# Altium project BalanceCar_20210328.PrjPcb
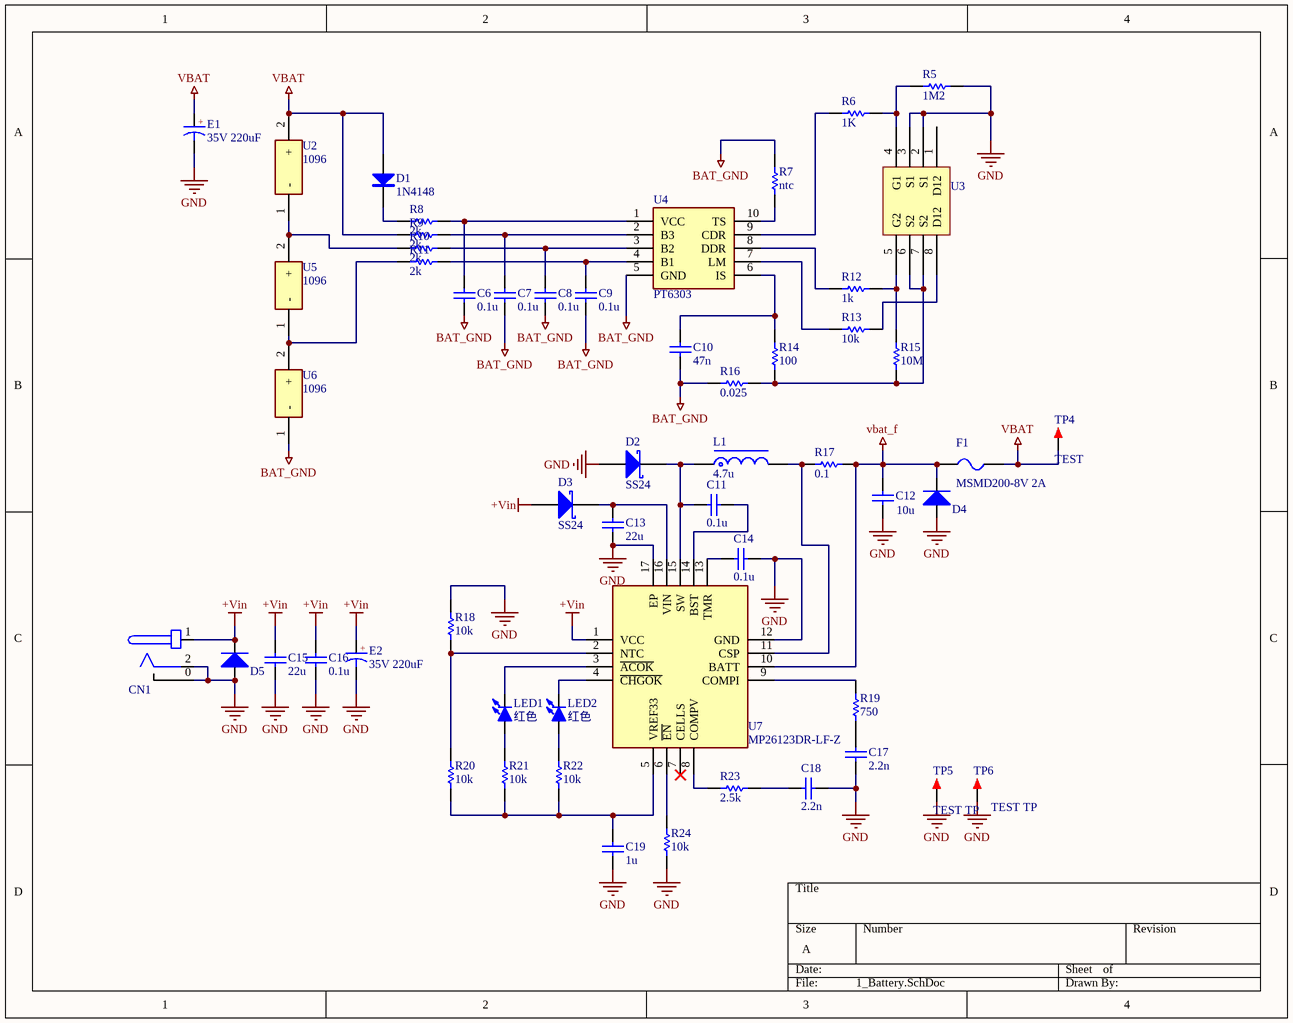
[diagram p0: 1_Battery.SchDoc]
6 sheets, 162 parts. Net scope: global (net labels, ports and power ports of the same name join across sheets).
Board file: BalanceCar.PcbDoc
Sheets:
  1_Battery.SchDoc
  2_Power.SchDoc
  3_MCU.SchDoc
  4_MotorDrive.SchDoc
  5_Ble.SchDoc
  6_mpu6050.SchDoc

## Sheet 1_Battery.SchDoc
size A

### Parts
C6  0.1u  [CAP_0603_SMD]
C7  0.1u  [CAP_0603_SMD]
C8  0.1u  [CAP_0603_SMD]
C9  0.1u  [CAP_0603_SMD]
C10  47n  [CAP_0603_SMD]
C11  0.1u  [CAP_0603_SMD]
C12  10u  [C1206_L]
C13  22u  [C1812_L]
C14  0.1u  [CAP_0603_SMD]
C15  22u  [C1812_L]
C16  0.1u  [CAP_0603_SMD]
C17  2.2n  [CAP_0603_SMD]
C18  2.2n  [CAP_0603_SMD]
C19  1u  [CAP_0603_SMD]
CN1  PWR5.5x2.1_HP  [PWR5.5x2.1_HP]  (value not drawn)
D1  1N4148  [SOD-323]
D2  SS24  [SMB]
D3  SS24  [SMB]
D4  TVS  [SMA]  (value not drawn)
D5  TVS  [SMA]  (value not drawn)
E1  35V 220uF  [CE E(8*10.2)]
E2  35V 220uF  [CE E(8*10.2)]
F1  MSMD200-8V 2A  [FU 1812]
L1  4.7u  [L-SMD-0630]
LED1  红色  [LED0603_Y]
LED2  红色  [LED0603_Y]
R5  1M2  [RES_0603_SMD]
R6  1K  [RES_0603_SMD]
R7  ntc  [RES_0603_SMD]
R8  2k  [RES_0603_SMD]
R9  2k  [RES_0603_SMD]
R10  2k  [RES_0603_SMD]
R11  2k  [RES_0603_SMD]
R12  1k  [RES_0603_SMD]
R13  10k  [RES_0603_SMD]
R14  100  [RES_0603_SMD]
R15  10M  [RES_0603_SMD]
R16  0.025  [RES_1206_SMD]
R17  0.1  [RES_1206_SMD]
R18  10k  [RES_0603_SMD]
R19  750  [RES_0603_SMD]
R20  10k  [RES_0603_SMD]
R21  10k  [RES_0603_SMD]
R22  10k  [RES_0603_SMD]
R23  2.5k  [RES_0603_SMD]
R24  10k  [RES_0603_SMD]
TP4  TEST  [TEST 1.2]
TP5  TEST TP  [TEST TP1.4_BK]
TP6  TEST TP  [TEST TP1.4_BK]
U2  1096  [1096]
U3  FS8205A TSSOP-8  [IC_TSSOP-8]  (value not drawn)
U4  PT6303  [SOP50P490X110-10N]
U5  1096  [1096]
U6  1096  [1096]
U7  MP26123DR-LF-Z  [QFN65P400X400X100-17N-D]

### Nets
+Vin: C15.2 C16.2 CN1.1(+) D3.1(A) D5.2(K) E2.1 U7.1(VCC)
BAT_GND: C6.2 C7.2 C8.2 C9.2 C10.2 R7.1 R16.1 U4.5(GND) U6.1(-)
GND: C12.1 C13.1 C14.2 C15.1 C16.1 C17.1 C18.1 C19.2 CN1.0(SHIELD) CN1.2(GND) D2.1(A) D4.1(A) D5.1(A) E1.2 E2.2 R5.1 R18.2 R24.2 TP5.1 TP6.1 U3.2(S1) U3.3(S1) U7.12(GND) U7.17(EP)
VBAT: D1.1(A) E1.1 F1.2 R9.2 TP4.1 U2.2(+)
vbat_f: C12.2 D4.2(K) F1.1 R17.2 U7.10(BATT)
NetC6_1: C6.1 R8.1 U4.1(VCC)
NetC7_1: C7.1 R9.1 U4.2(B3)
NetC8_1: C8.1 R10.1 U4.3(B2)
NetC9_1: C9.1 R11.1 U4.4(B1)
NetC10_1: C10.1 R14.1 U4.6(IS)
NetC11_1: C11.1 D2.2(K) L1.1 U7.15(SW)
NetC11_2: C11.2 U7.14(BST)
NetC13_2: C13.2 D3.2(K) U7.16(VIN)
NetC14_1: C14.1 U7.13(TMR)
NetC17_2: C17.2 R19.2
NetC18_2: C18.2 R23.1
NetC19_1: C19.1 R20.1 R21.1 R22.1 U7.5(VREF33)
NetD1_2: D1.2(K) R8.2
NetL1_2: L1.2 R17.1 U7.11(CSP)
NetLED1_1: LED1.1(A) R21.2
NetLED1_2: LED1.2(K) U7.3(~{ACOK})
NetLED2_1: LED2.1(A) R22.2
NetLED2_2: LED2.2(K) U7.4(~{CHGOK})
NetR5_2: R5.2 R6.1 U3.4(G1)
NetR6_2: R6.2 U4.9(CDR)
NetR7_2: R7.2 U4.10(TS)
NetR10_2: R10.2 U2.1(-) U5.2(+)
NetR11_2: R11.2 U5.1(-) U6.2(+)
NetR12_1: R12.1 R15.1 U3.5(G2)
NetR12_2: R12.2 U4.8(DDR)
NetR13_1: R13.1 U3.8(D12)
NetR13_2: R13.2 U4.7(LM)
NetR14_2: R14.2 R15.2 R16.2 U3.6(S2) U3.7(S2)
NetR18_1: R18.1 R20.2 U7.2(NTC)
NetR19_1: R19.1 U7.9(COMPI)
NetR23_2: R23.2 U7.8(COMPV)
NetR24_1: R24.1 U7.6(~{EN})

Not connected (* = marked no-connect by the designer): U3 1(D12); U7 7(CELLS)*

### Notes on the sheet
- (in symbol CE_SMD) +

### Library data of the parts
C6-C11 C14 C16-C19 = CAP_0603_SMD: Capacitor, 0603, SMD; Published: 8-Jun-2000; LatestRevisionDate: 17-Jul-2002; LatestRevisionNote: Re-released for DXP Platform.; PackageReference: RAD-0.3; Publisher: Altium Limited
C12 C13 C15 = C: 贴片电容; BOM名称: 无极性贴片电容; 联系卖家，免费查找封装: 唯一出售店铺网址https://shop463601444.taobao.com; 封装库来自淘宝卖家ID：黄晶宝石: 其他店铺购入均为盗版假冒封装库，请立即申请退款
CN1 = PWR5.5x2.1_HP: DC Socket, 5.5x2.1, High-power
D1 = 1N4148: 开关二极管; BOM名称: 高速开关二极管; 联系卖家，免费查找封装: 唯一出售店铺网址https://shop463601444.taobao.com
D2 D3 = SS24: 肖特基二极管; 属性: 40V/2A; 联系卖家，免费查找封装: 唯一出售店铺网址https://shop463601444.taobao.com; BOM名称: 肖特基二极管
D4 D5 = TVS: TVS通用; 联系卖家，免费查找封装: 唯一出售店铺网址https://shop463601444.taobao.com; Code_JEDEC: DO-214-AB
E1 E2 = CE_SMD: 贴片电解电容; 联系卖家，免费查找封装: 唯一出售店铺网址https://shop463601444.taobao.com; 封装库来自淘宝卖家ID：黄晶宝石: 其他店铺购入均为盗版假冒封装库，请立即申请退款; BOM名称: 贴片电解电容
F1 = FU: 贴片保险丝; 联系卖家，免费查找封装: 唯一出售店铺网址https://shop463601444.taobao.com; BOM名称: 贴片保险丝
L1 = L-Molding Choke: 一体成型电感; 联系卖家，免费查找封装: 唯一出售店铺网址https://shop463601444.taobao.com; 封装库来自淘宝卖家ID：黄晶宝石: 其他店铺购入均为盗版假冒封装库，请立即申请退款; BOM名称: 一体成型电感
LED1 LED2 = LED-SMD: 贴片LED; 封装库来自淘宝卖家 ID：黄晶宝石: 其他店铺购入均为假冒，请立即申请退款，本店奖励现金5~20元; BOM名称: 贴片LED
R5-R15 R18-R24 = RES_0603_SMD: Resistor, 0603, SMD; Published: 8-Jun-2000; LatestRevisionDate: 17-Jul-2002; LatestRevisionNote: Re-released for DXP Platform.; PackageReference: AXIAL-0.3; Publisher: Altium Limited; Value: Value
R16 R17 = RES_1206_SMD: Resistor, 1206, SMD; Published: 8-Jun-2000; LatestRevisionDate: 17-Jul-2002; LatestRevisionNote: Re-released for DXP Platform.; PackageReference: AXIAL-0.3; Publisher: Altium Limited; Value: Value
TP4 = TEST: 测试点; 联系卖家，免费查找封装: 唯一出售店铺网址https://shop463601444.taobao.com; BOM名称: 测试点
TP5 TP6 = TEST TP: 测试环; 联系卖家，免费查找封装: 唯一出售店铺网址https://shop463601444.taobao.com; BOM名称: 测试环
U2 U5 U6 = 1096: Undefined or Miscellaneous; Manufacturer_Name: Keystone Electronics; Datasheet Link: http://www.keyelco.com/product-pdf.cfm?p=14034; Height: 14.86mm; Manufacturer_Part_Number: 1096; Mouser Part Number: 534-1096; Mouser Price/Stock: https://www.mouser.co.uk/ProductDetail/Keystone-Electronics/1096?qs=lpFmnCe%2FWT9bsXx2ZUVLWQ%3D%3D
U3 = FS8205A TSSOP-8: Dual N-Channel Enhancement Mode Power MOSFET
U4 = PT6303: Integrated Circuit; Datasheet Link: http://www.analog.com/media/en/technical-documentation/data-sheets/AD4001-4005.pdf; Height: 1.1mm; Arrow Part Number: AD4001BRMZ; Arrow Price/Stock: https://www.arrow.com/en/products/ad4001brmz/analog-devices
U7 = MP26123DR-LF-Z: Integrated Circuit; Manufacturer_Name: Monolithic Power Systems (MPS); Datasheet Link: https://www.monolithicpower.com/pub/media/document/MP26123_r1.01.pdf; Height: 1mm; Manufacturer_Part_Number: MP26123DR-LF-Z; Mouser Part Number: 946-MP26123DRLFZ; Mouser Price/Stock: https://www.mouser.co.uk/ProductDetail/Monolithic-Power-Systems-MPS/MP26123DR-LF-Z?qs=ddTkeYFZflVgOJRHHyrLxQ%3D%3D

## Sheet 2_Power.SchDoc
size A
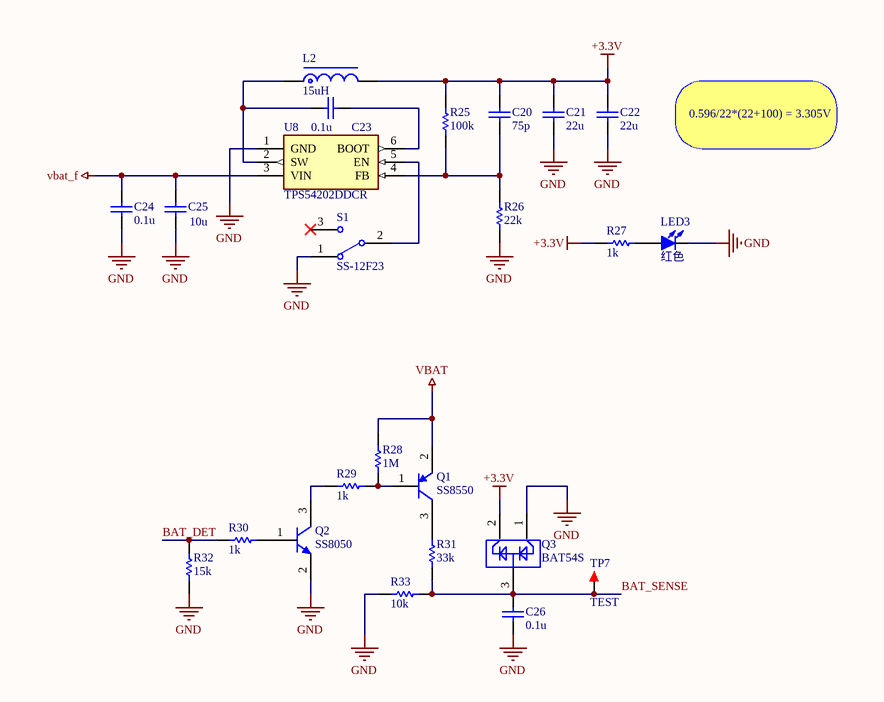
[diagram p1: 2_Power.SchDoc]

### Parts
C20  75p  [CAP_0603_SMD]
C21  22u  [C1206_L]
C22  22u  [C1206_L]
C23  0.1u  [CAP_0603_SMD]
C24  0.1u  [CAP_0603_SMD]
C25  10u  [C1206_L]
C26  0.1u  [CAP_0603_SMD]
L2  15uH  [L-SMD-0630]
LED3  红色  [LED0603_Y]
Q1  SS8550  [TR_SOT-23]
Q2  SS8050  [TR_SOT-23]
Q3  BAT54S  [TR_SOT-23]
R25  100k  [RES_0603_SMD]
R26  22k  [RES_0603_SMD]
R27  1k  [RES_0603_SMD]
R28  1M  [RES_0603_SMD]
R29  1k  [RES_0603_SMD]
R30  1k  [RES_0603_SMD]
R31  33k  [RES_0603_SMD]
R32  15k  [RES_0603_SMD]
R33  10k  [RES_0603_SMD]
S1  SS-12F23  [SS-12F23]
TP7  TEST  [TEST 1.2]
U8  TPS54202DDCR  [SOT95P280X110-6N]

### Nets
+3.3V: C20.1 C21.2 C22.2 L2.2 Q3.2 R25.2 R27.2
GND: C21.1 C22.1 C24.1 C25.1 C26.1 LED3.2(K) Q2.2(E) Q3.1 R26.1 R32.1 R33.1 S1.1 U8.1(GND)
VBAT: Q1.2(E) R28.2
vbat_f: C24.2 C25.2 U8.3(VIN)
BAT_DET: R30.1 R32.2
BAT_SENSE: C26.2 Q3.3 R31.2 R33.2 TP7.1
NetC20_2: C20.2 R25.1 R26.2 U8.4(FB)
NetC23_1: C23.1 U8.6(BOOT)
NetC23_2: C23.2 L2.1 U8.2(SW)
NetLED3_1: LED3.1(A) R27.1
NetQ1_1: Q1.1(B) R28.1 R29.1
NetQ1_3: Q1.3(C) R31.1
NetQ2_1: Q2.1(B) R30.2
NetQ2_3: Q2.3(C) R29.2
NetS1_2: S1.2 U8.5(EN)

Not connected (* = marked no-connect by the designer): S1 3*

### Notes on the sheet
- 0.596/22*(22+100) = 3.305V

### Library data of the parts
C20 C23 C24 C26 = CAP_0603_SMD: Capacitor, 0603, SMD; Published: 8-Jun-2000; LatestRevisionDate: 17-Jul-2002; LatestRevisionNote: Re-released for DXP Platform.; PackageReference: RAD-0.3; Publisher: Altium Limited
C21 C22 C25 = C: as C12 on sheet 1_Battery
L2 = L-Molding Choke: as L1 on sheet 1_Battery; BOM名称: 一体成型电感
LED3 = LED-SMD: as LED1 on sheet 1_Battery; BOM名称: 贴片LED
Q1 = PNP SS8550: PNP SS8550, -25V -1.5A, SOT-23; Published: 8-Jun-2000; LatestRevisionDate: 29-May-2009; LatestRevisionNote: IPC-7351 Footprint Added.; PackageVersion: Aug-1999; PackageReference: SOT-23B; Publisher: Altium Limited; PackageDescription: 3-Pin SOT-23 Package 0.95 mm Pitch, 2.4 mm Lead Span
Q2 = NPN SS8050: NPN SS8050, 25V 1.5A, SOT-23; Published: 8-Jun-2000; LatestRevisionDate: 17-Jul-2002; LatestRevisionNote: Re-released for DXP Platform.; PackageReference: TO-226; Publisher: Altium Limited; Code_JEDEC: TO-226-AA
Q3 = BAT54S: Dual Schottky Diodes, SOT23
R25-R33 = RES_0603_SMD: Resistor, 0603, SMD; Published: 8-Jun-2000; LatestRevisionDate: 17-Jul-2002; LatestRevisionNote: Re-released for DXP Platform.; PackageReference: AXIAL-0.3; Publisher: Altium Limited; Value: Value
S1 = SSW-1P: 1路波动开关; BOM名称: 波动开关; 联系卖家，免费查找封装: 唯一出售店铺网址https://shop463601444.taobao.com
TP7 = TEST: as TP4 on sheet 1_Battery; BOM名称: 测试点
U8 = TPS54202DDCR: Power Supply; Manufacturer_Name: Texas Instruments; Datasheet Link: http://www.ti.com/lit/gpn/tps54202; Height: 1.1mm; Manufacturer_Part_Number: TPS54202DDCR; Arrow Part Number: TPS54202DDCR; Arrow Price/Stock: https://www.arrow.com/en/products/tps54202ddcr/texas-instruments; Mouser Part Number: 595-TPS54202DDCR; Mouser Price/Stock: https://www.mouser.co.uk/ProductDetail/Texas-Instruments/TPS54202DDCR?qs=uP22XH7NdCsJtN%2Fq54jCtQ%3D%3D

## Sheet 3_MCU.SchDoc
size A
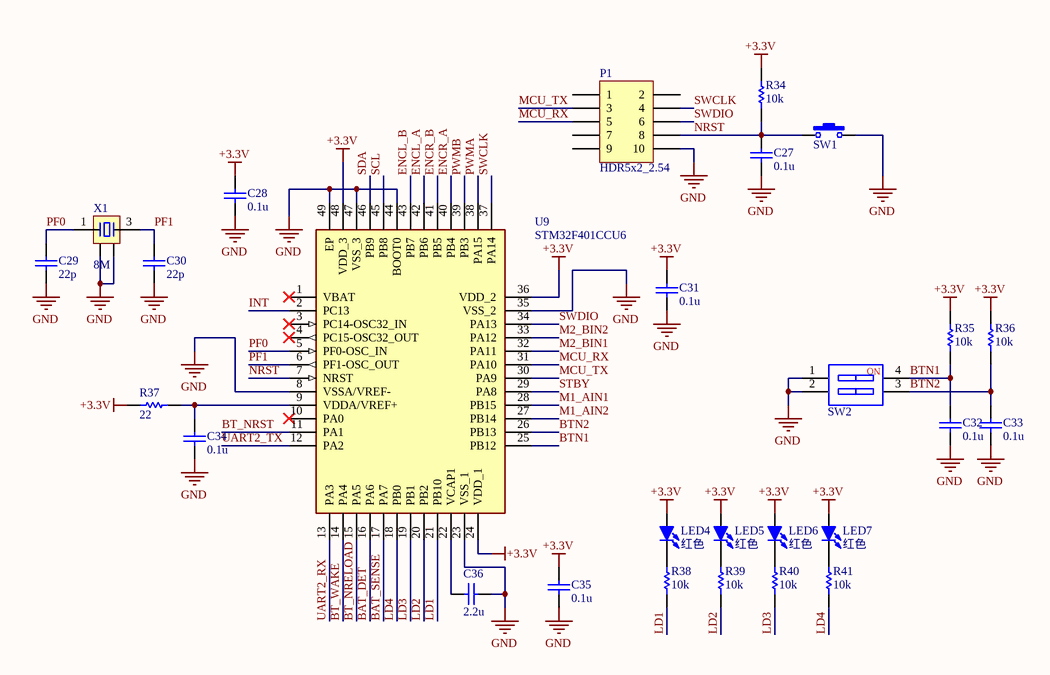
[diagram p2: 3_MCU.SchDoc]

### Parts
C27  0.1u  [CAP_0603_SMD]
C28  0.1u  [CAP_0603_SMD]
C29  22p  [CAP_0603_SMD]
C30  22p  [CAP_0603_SMD]
C31  0.1u  [CAP_0603_SMD]
C32  0.1u  [CAP_0603_SMD]
C33  0.1u  [CAP_0603_SMD]
C34  0.1u  [CAP_0603_SMD]
C35  0.1u  [CAP_0603_SMD]
C36  2.2u  [CAP_0603_SMD]
LED4  红色  [LED0603_Y]
LED5  红色  [LED0603_Y]
LED6  红色  [LED0603_Y]
LED7  红色  [LED0603_Y]
P1  HDR5x2_2.54  [HDR5x2_2.54]
R34  10k  [RES_0603_SMD]
R35  10k  [RES_0603_SMD]
R36  10k  [RES_0603_SMD]
R37  22  [RES_0603_SMD]
R38  10k  [RES_0603_SMD]
R39  10k  [RES_0603_SMD]
R40  10k  [RES_0603_SMD]
R41  10k  [RES_0603_SMD]
SW1  3x6x5  [SW SMD-3*6*4.3]  (value not drawn)
SW2  SW-2P  [SW1.27 SMD-2P]  (value not drawn)
U9  STM32F401CCU6  [QFN50P700X700X60-49N-D]
X1  8M  [OSC 3225-4P]

### Nets
+3.3V: C28.1 C31.1 C35.1 LED4.1(A) LED5.1(A) LED6.1(A) LED7.1(A) R34.2 R35.1 R36.1 R37.2 U9.24(VDD_1) U9.36(VDD_2) U9.48(VDD_3)
GND: C27.1 C28.2 C29.2 C30.2 C31.2 C32.1 C33.1 C34.2 C35.2 C36.1 P1.10 SW1.2 SW2.1 SW2.2 U9.8(VSSA/VREF-) U9.23(VSS_1) U9.35(VSS_2) U9.44(BOOT0) U9.47(VSS_3) U9.49(EP) X1.2 X1.4
BAT_DET: U9.16(PA6)
BAT_SENSE: U9.17(PA7)
BT_NRELOAD: U9.15(PA5)
BT_NRST: U9.11(PA1)
BT_WAKE: U9.14(PA4)
BTN1: C32.2 R35.2 SW2.4 U9.25(PB12)
BTN2: C33.2 R36.2 SW2.3 U9.26(PB13)
ENCL_A: U9.42(PB6)
ENCL_B: U9.43(PB7)
ENCR_A: U9.40(PB4)
ENCR_B: U9.41(PB5)
INT: U9.2(PC13)
LD1: R38.2 U9.21(PB10)
LD2: R39.2 U9.20(PB2)
LD3: R40.2 U9.19(PB1)
LD4: R41.2 U9.18(PB0)
M1_AIN1: U9.28(PB15)
M1_AIN2: U9.27(PB14)
M2_BIN1: U9.32(PA11)
M2_BIN2: U9.33(PA12)
MCU_RX: P1.5 U9.31(PA10)
MCU_TX: P1.3 U9.30(PA9)
NRST: C27.2 P1.8 R34.1 SW1.1 U9.7(NRST)
PF0: C29.1 U9.5(PF0-OSC_IN) X1.1
PF1: C30.1 U9.6(PF1-OSC_OUT) X1.3
PWMA: U9.38(PA15)
PWMB: U9.39(PB3)
SCL: U9.45(PB8)
SDA: U9.46(PB9)
STBY: U9.29(PA8)
SWCLK: P1.4 U9.37(PA14)
SWDIO: P1.6 U9.34(PA13)
UART2_RX: U9.13(PA3)
UART2_TX: U9.12(PA2)
NetC34_1: C34.1 R37.1 U9.9(VDDA/VREF+)
NetC36_2: C36.2 U9.22(VCAP1)
NetLED4_2: LED4.2(K) R38.1
NetLED5_2: LED5.2(K) R39.1
NetLED6_2: LED6.2(K) R40.1
NetLED7_2: LED7.2(K) R41.1

Not connected (* = marked no-connect by the designer): P1 1 2 7 9; U9 1(VBAT)* 3(PC14-OSC32_IN)* 4(PC15-OSC32_OUT)* 10(PA0)*

### Notes on the sheet
- (in symbol SW-2P) NO

### Library data of the parts
C27-C36 = CAP_0603_SMD: Capacitor, 0603, SMD; Published: 8-Jun-2000; LatestRevisionDate: 17-Jul-2002; LatestRevisionNote: Re-released for DXP Platform.; PackageReference: RAD-0.3; Publisher: Altium Limited
LED4-LED7 = LED-SMD: as LED1 on sheet 1_Battery; BOM名称: 贴片LED
P1 = HDR5x2_2.54: Header, 10-Pin, 2-Row; LatestRevisionDate: 17-Jul-2002; LatestRevisionNote: Re-released for DXP Platform.; Publisher: Altium Limited
R34-R41 = RES_0603_SMD: Resistor, 0603, SMD; Published: 8-Jun-2000; LatestRevisionDate: 17-Jul-2002; LatestRevisionNote: Re-released for DXP Platform.; PackageReference: AXIAL-0.3; Publisher: Altium Limited; Value: Value
SW1 = SW-PB: 微动开关; BOM名称: 3x6轻触开关; 联系卖家，免费查找封装: 唯一出售店铺网址https://shop463601444.taobao.com
SW2 = SW-2P: 2路编码开关; 联系卖家，免费查找封装: 唯一出售店铺网址https://shop463601444.taobao.com; BOM名称: 2路编码开关
U9 = STM32F401CCU6: Integrated Circuit; Manufacturer_Name: STMicroelectronics; Datasheet Link: http://www.st.com/web/en/resource/technical/document/datasheet/DM00086815.pdf; Height: 0.6mm; Manufacturer_Part_Number: STM32F401CCU6; Mouser Part Number: 511-STM32F401CCU6; Mouser Price/Stock: https://www.mouser.co.uk/ProductDetail/STMicroelectronics/STM32F401CCU6?qs=DqCdCwOw4%2F5VrOZQxO795A%3D%3D; Arrow Part Number: STM32F401CCU6; Arrow Price/Stock: https://www.arrow.com/en/products/stm32f401ccu6/stmicroelectronics
X1 = XTAL-4P: 4脚无源晶振; 联系卖家，免费查找封装: 唯一出售店铺网址https://shop463601444.taobao.com; BOM名称: 4脚无源晶振

## Sheet 4_MotorDrive.SchDoc
size A
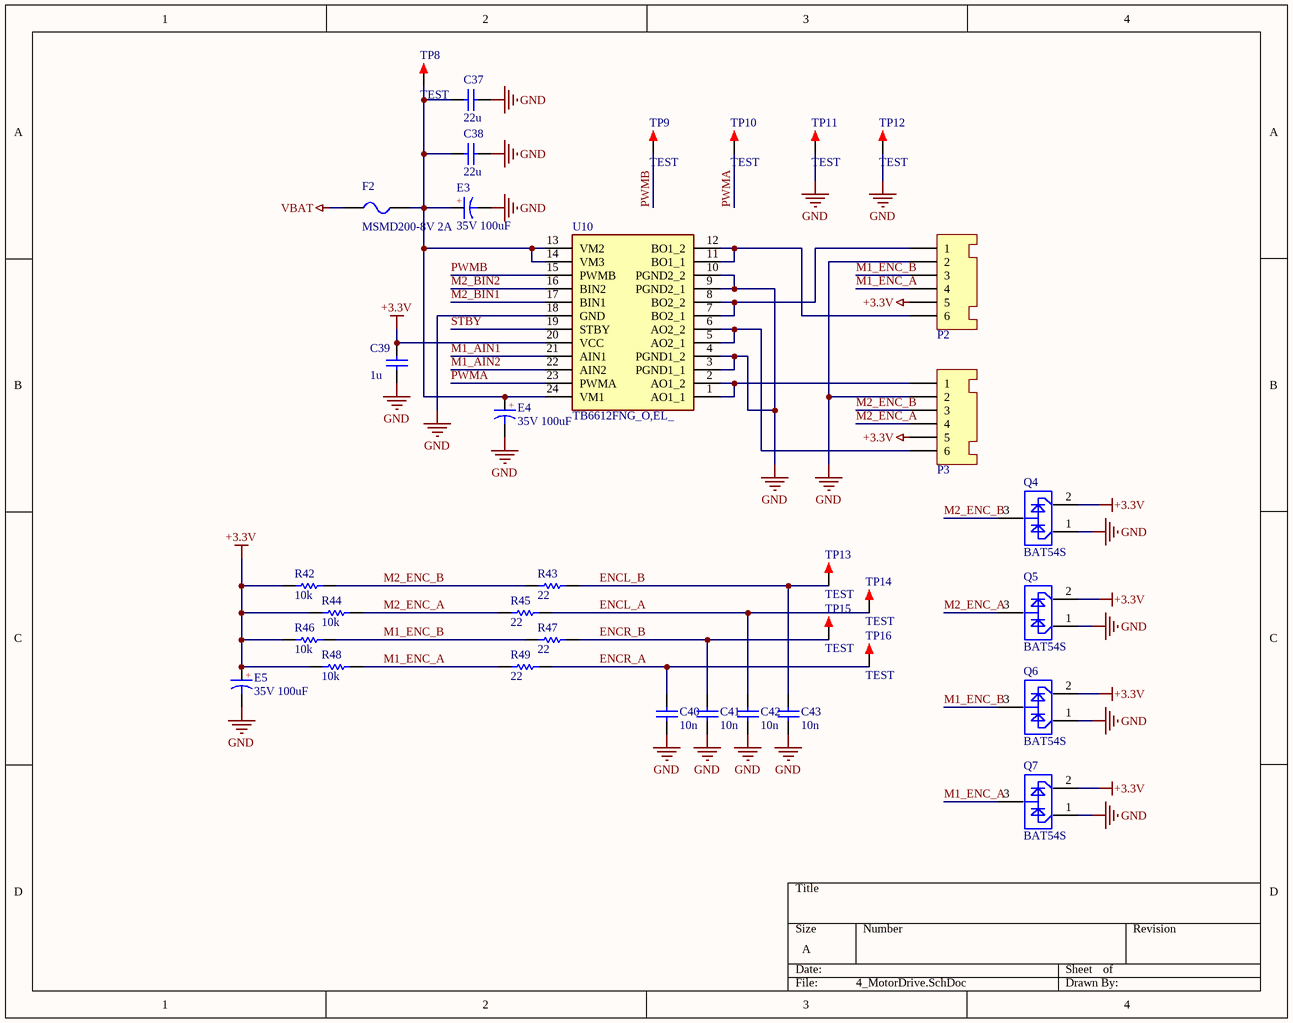
[diagram p3: 4_MotorDrive.SchDoc]

### Parts
C37  22u  [C1812_L]
C38  22u  [C1812_L]
C39  1u  [CAP_0603_SMD]
C40  10n  [CAP_0603_SMD]
C41  10n  [CAP_0603_SMD]
C42  10n  [CAP_0603_SMD]
C43  10n  [CAP_0603_SMD]
E3  35V 100uF  [CE D(6.3*7.7)]
E4  35V 100uF  [CE D(6.3*7.7)]
E5  35V 100uF  [CE D(6.3*7.7)]
F2  MSMD200-8V 2A  [FU 1812]
P2  HDR-1X6  [XH2.54-WS-6P]  (value not drawn)
P3  HDR-1X6  [XH2.54-WS-6P]  (value not drawn)
Q4  BAT54S  [TR_SOT-23]
Q5  BAT54S  [TR_SOT-23]
Q6  BAT54S  [TR_SOT-23]
Q7  BAT54S  [TR_SOT-23]
R42  10k  [RES_0603_SMD]
R43  22  [RES_0603_SMD]
R44  10k  [RES_0603_SMD]
R45  22  [RES_0603_SMD]
R46  10k  [RES_0603_SMD]
R47  22  [RES_0603_SMD]
R48  10k  [RES_0603_SMD]
R49  22  [RES_0603_SMD]
TP8  TEST  [TEST 1.2]
TP9  TEST  [TEST 1.2]
TP10  TEST  [TEST 1.2]
TP11  TEST  [TEST 1.2]
TP12  TEST  [TEST 1.2]
TP13  TEST  [TEST 1.2]
TP14  TEST  [TEST 1.2]
TP15  TEST  [TEST 1.2]
TP16  TEST  [TEST 1.2]
U10  TB6612FNG_O,EL_  [SOP65P760X160-24N]

### Nets
+3.3V: C39.1 E5.1 P2.5 P3.5 Q4.2 Q5.2 Q6.2 Q7.2 R42.2 R44.2 R46.2 R48.2 U10.20(VCC)
GND: C37.1 C38.1 C39.2 C40.2 C41.2 C42.2 C43.2 E3.2 E4.2 E5.2 P2.2 P3.2 Q4.1 Q5.1 Q6.1 Q7.1 TP11.1 TP12.1 U10.3(PGND1_1) U10.4(PGND1_2) U10.9(PGND2_1) U10.10(PGND2_2) U10.18(GND)
VBAT: F2.1
ENCL_A: C42.1 R45.1 TP14.1
ENCL_B: C43.1 R43.1 TP13.1
ENCR_A: C40.1 R49.1 TP16.1
ENCR_B: C41.1 R47.1 TP15.1
M1_AIN1: U10.21(AIN1)
M1_AIN2: U10.22(AIN2)
M1_ENC_A: P2.4 Q7.3 R48.1 R49.2
M1_ENC_B: P2.3 Q6.3 R46.1 R47.2
M2_BIN1: U10.17(BIN1)
M2_BIN2: U10.16(BIN2)
M2_ENC_A: P3.4 Q5.3 R44.1 R45.2
M2_ENC_B: P3.3 Q4.3 R42.1 R43.2
PWMA: TP10.1 U10.23(PWMA)
PWMB: TP9.1 U10.15(PWMB)
STBY: U10.19(STBY)
NetC37_2: C37.2 C38.2 E3.1 E4.1 F2.2 TP8.1 U10.13(VM2) U10.14(VM3) U10.24(VM1)
NetP2_1: P2.1 U10.7(BO2_1) U10.8(BO2_2)
NetP2_6: P2.6 U10.11(BO1_1) U10.12(BO1_2)
NetP3_1: P3.1 U10.1(AO1_1) U10.2(AO1_2)
NetP3_6: P3.6 U10.5(AO2_1) U10.6(AO2_2)

### Notes on the sheet
- (in symbol CE_SMD) +

### Library data of the parts
C37 C38 = C: as C12 on sheet 1_Battery
C39-C43 = CAP_0603_SMD: Capacitor, 0603, SMD; Published: 8-Jun-2000; LatestRevisionDate: 17-Jul-2002; LatestRevisionNote: Re-released for DXP Platform.; PackageReference: RAD-0.3; Publisher: Altium Limited
E3-E5 = CE_SMD: as E1 on sheet 1_Battery; BOM名称: 贴片电解电容
F2 = FU: as F1 on sheet 1_Battery; BOM名称: 贴片保险丝
P2 P3 = Header 6: 6P接插件; 封装库来自淘宝卖家 ID：黄晶宝石: 其他店铺购入均为盗版假冒封装库; 联系卖家，免费查找封装: 唯一出售店铺网址https://shop463601444.taobao.com; BOM名称: 6P接插件
Q4-Q7 = BAT54S: Dual Schottky Diodes, SOT23
R42-R49 = RES_0603_SMD: Resistor, 0603, SMD; Published: 8-Jun-2000; LatestRevisionDate: 17-Jul-2002; LatestRevisionNote: Re-released for DXP Platform.; PackageReference: AXIAL-0.3; Publisher: Altium Limited; Value: Value
TP8-TP16 = TEST: as TP4 on sheet 1_Battery; BOM名称: 测试点
U10 = TB6612FNG_O,EL_: Integrated Circuit; Manufacturer_Name: Toshiba; Manufacturer_Part_Number: TB6612FNG(O,EL); Datasheet Link: https://th.mouser.com/datasheet/2/408/TB6612FNG_datasheet_en_20141001-708260.pdf; Height: 1.6mm; Arrow Part Number: TB6612FNG(O,EL); Mouser Part Number: 757-TB6612FNG(O,EL); Mouser Price/Stock: https://www.mouser.co.uk/ProductDetail/Toshiba/TB6612FNGOEL?qs=%2FbfygUuxYr5ys7QLPOzyng%3D%3D

## Sheet 5_Ble.SchDoc
size A
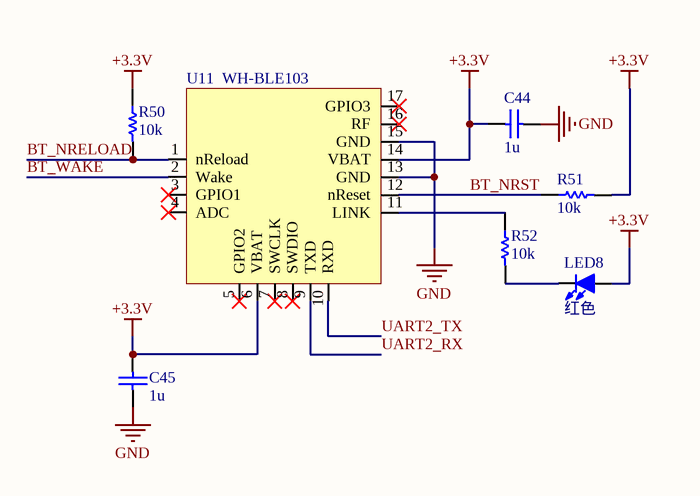
[diagram p4: 5_Ble.SchDoc]

### Parts
C44  1u  [CAP_0603_SMD]
C45  1u  [CAP_0603_SMD]
LED8  红色  [LED0603_Y]
R50  10k  [RES_0603_SMD]
R51  10k  [RES_0603_SMD]
R52  10k  [RES_0603_SMD]
U11  WH-BLE103  [PCBComponent_1]

### Nets
+3.3V: C44.2 C45.1 LED8.1(A) R50.1 R51.2 U11.6(VBAT) U11.14(VBAT)
GND: C44.1 C45.2 U11.13(GND) U11.15(GND)
BT_NRELOAD: R50.2 U11.1(nReload)
BT_NRST: R51.1 U11.12(nReset)
BT_WAKE: U11.2(Wake)
UART2_RX: U11.9(TXD)
UART2_TX: U11.10(RXD)
NetLED8_2: LED8.2(K) R52.2
NetR52_1: R52.1 U11.11(LINK)

Not connected (* = marked no-connect by the designer): U11 3(GPIO1)* 4(ADC)* 5(GPIO2)* 7(SWCLK)* 8(SWDIO)* 16(RF)* 17(GPIO3)*

### Library data of the parts
C44 C45 = CAP_0603_SMD: Capacitor, 0603, SMD; Published: 8-Jun-2000; LatestRevisionDate: 17-Jul-2002; LatestRevisionNote: Re-released for DXP Platform.; PackageReference: RAD-0.3; Publisher: Altium Limited
LED8 = LED-SMD: as LED1 on sheet 1_Battery; BOM名称: 贴片LED
R50-R52 = RES_0603_SMD: Resistor, 0603, SMD; Published: 8-Jun-2000; LatestRevisionDate: 17-Jul-2002; LatestRevisionNote: Re-released for DXP Platform.; PackageReference: AXIAL-0.3; Publisher: Altium Limited; Value: Value

## Sheet 6_mpu6050.SchDoc
size A
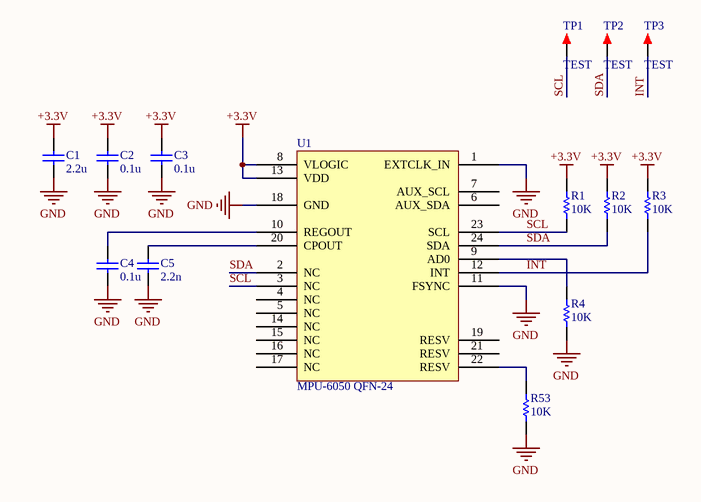
[diagram p5: 6_mpu6050.SchDoc]

### Parts
C1  2.2u  [CAP_0603_SMD]
C2  0.1u  [CAP_0603_SMD]
C3  0.1u  [CAP_0603_SMD]
C4  0.1u  [CAP_0603_SMD]
C5  2.2n  [CAP_0603_SMD]
R1  10K  [RES_0603_SMD]
R2  10K  [RES_0603_SMD]
R3  10K  [RES_0603_SMD]
R4  10K  [RES_0603_SMD]
R53  10K  [RES_0603_SMD]
TP1  TEST  [TEST 1.2]
TP2  TEST  [TEST 1.2]
TP3  TEST  [TEST 1.2]
U1  MPU-6050 QFN-24  [IC_QFN-24_4x4_NoExposedPad]

### Nets
+3.3V: C1.2 C2.2 C3.2 R1.2 R2.2 R3.2 U1.8(VLOGIC) U1.13(VDD)
GND: C1.1 C2.1 C3.1 C4.2 C5.2 R4.1 R53.1 U1.1(EXTCLK_IN) U1.11(FSYNC) U1.18(GND)
INT: R3.1 TP3.1 U1.12(INT)
SCL: R1.1 TP1.1 U1.3(NC) U1.23(SCL)
SDA: R2.1 TP2.1 U1.2(NC) U1.24(SDA)
NetC4_1: C4.1 U1.10(REGOUT)
NetC5_1: C5.1 U1.20(CPOUT)
NetR4_2: R4.2 U1.9(AD0)
NetR53_2: R53.2 U1.22(RESV)

Not connected (* = marked no-connect by the designer): U1 4(NC) 5(NC) 6(AUX_SDA) 7(AUX_SCL) 14(NC) 15(NC) 16(NC) 17(NC) 19(RESV) 21(RESV)

### Library data of the parts
C1-C5 = CAP_0603_SMD: Capacitor, 0603, SMD; Published: 8-Jun-2000; LatestRevisionDate: 17-Jul-2002; LatestRevisionNote: Re-released for DXP Platform.; PackageReference: RAD-0.3; Publisher: Altium Limited
R1-R4 R53 = RES_0603_SMD: Resistor, 0603, SMD; Published: 8-Jun-2000; LatestRevisionDate: 17-Jul-2002; LatestRevisionNote: Re-released for DXP Platform.; PackageReference: AXIAL-0.3; Publisher: Altium Limited; Value: Value
TP1-TP3 = TEST: as TP4 on sheet 1_Battery; BOM名称: 测试点
U1 = MPU-6050 QFN24 4x4: Triple Axis Accelerometer and Gyro

## Nets that join several sheets
+3.3V: 2_Power (7 pins), 3_MCU (14 pins), 4_MotorDrive (13 pins), 5_Ble (7 pins), 6_mpu6050 (8 pins)
GND: 1_Battery (24 pins), 2_Power (13 pins), 3_MCU (22 pins), 4_MotorDrive (23 pins), 5_Ble (C44.1 C45.2 U11.13 U11.15), 6_mpu6050 (10 pins)
VBAT: 1_Battery (6 pins), 2_Power (Q1.2 R28.2), 4_MotorDrive (F2.1)
vbat_f: 1_Battery (5 pins), 2_Power (C24.2 C25.2 U8.3)
BAT_DET: 2_Power (R30.1 R32.2), 3_MCU (U9.16)
BAT_SENSE: 2_Power (5 pins), 3_MCU (U9.17)
BT_NRELOAD: 3_MCU (U9.15), 5_Ble (R50.2 U11.1)
BT_NRST: 3_MCU (U9.11), 5_Ble (R51.1 U11.12)
BT_WAKE: 3_MCU (U9.14), 5_Ble (U11.2)
ENCL_A: 3_MCU (U9.42), 4_MotorDrive (C42.1 R45.1 TP14.1)
ENCL_B: 3_MCU (U9.43), 4_MotorDrive (C43.1 R43.1 TP13.1)
ENCR_A: 3_MCU (U9.40), 4_MotorDrive (C40.1 R49.1 TP16.1)
ENCR_B: 3_MCU (U9.41), 4_MotorDrive (C41.1 R47.1 TP15.1)
INT: 3_MCU (U9.2), 6_mpu6050 (R3.1 TP3.1 U1.12)
M1_AIN1: 3_MCU (U9.28), 4_MotorDrive (U10.21)
M1_AIN2: 3_MCU (U9.27), 4_MotorDrive (U10.22)
M2_BIN1: 3_MCU (U9.32), 4_MotorDrive (U10.17)
M2_BIN2: 3_MCU (U9.33), 4_MotorDrive (U10.16)
PWMA: 3_MCU (U9.38), 4_MotorDrive (TP10.1 U10.23)
PWMB: 3_MCU (U9.39), 4_MotorDrive (TP9.1 U10.15)
SCL: 3_MCU (U9.45), 6_mpu6050 (R1.1 TP1.1 U1.3 U1.23)
SDA: 3_MCU (U9.46), 6_mpu6050 (R2.1 TP2.1 U1.2 U1.24)
STBY: 3_MCU (U9.29), 4_MotorDrive (U10.19)
UART2_RX: 3_MCU (U9.13), 5_Ble (U11.9)
UART2_TX: 3_MCU (U9.12), 5_Ble (U11.10)